# Altium schematic sheet XL-1005SYGC_C224703061_XL-1005SYGC_C22470306.schdoc
size 127 x 101 mm
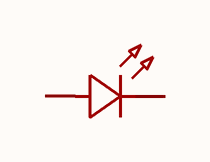
[diagram p0: XL-1005SYGC_C224703061_XL-1005SYGC_C22470306.schdoc]

## Parts
LED?  XL-1005SYGC  [LED-SMD_L1.1-W0.6-FD]  (value not drawn)

## Nets

Not connected (* = marked no-connect by the designer): LED? 1(K) 2(A)

## Library data of the parts
LED? = XL-1005SYGC_C22470306: Manufacturer: XINGLIGHT(成兴光); Add into BOM: yes; Forward Voltage (VF): 2.3V; Power Dissipation: 50mW; Forward Current: 20mA; Dominant Wavelength: 565nm~575nm; Peak Wavelength: 572nm; Lens Color: 无色透明透镜; Luminous Intensity: 240mcd; Viewing Angle: 120°; Mounting Sytle: 正贴; Symbol: XL-1005SYGC_C22470306; Device: XL-1005SYGC_C22470306; LCSC Part Name: XL-1005SYGC; Supplier Part: C22470306; Manufacturer Part: XL-1005SYGC; Supplier Footprint: 0402; JLCPCB Part Class: Extended Part; Datasheet: https://atta.szlcsc.com/upload/public/pdf/source/20240218/8EA55035A64B003AF213B47ACC00F41E.pdf; Supplier: LCSC; Convert to PCB: yes; Operating Temperature: -20℃~+85℃